# EAGLE design smarthome-agent-1 (EAGLE 9.1.0)
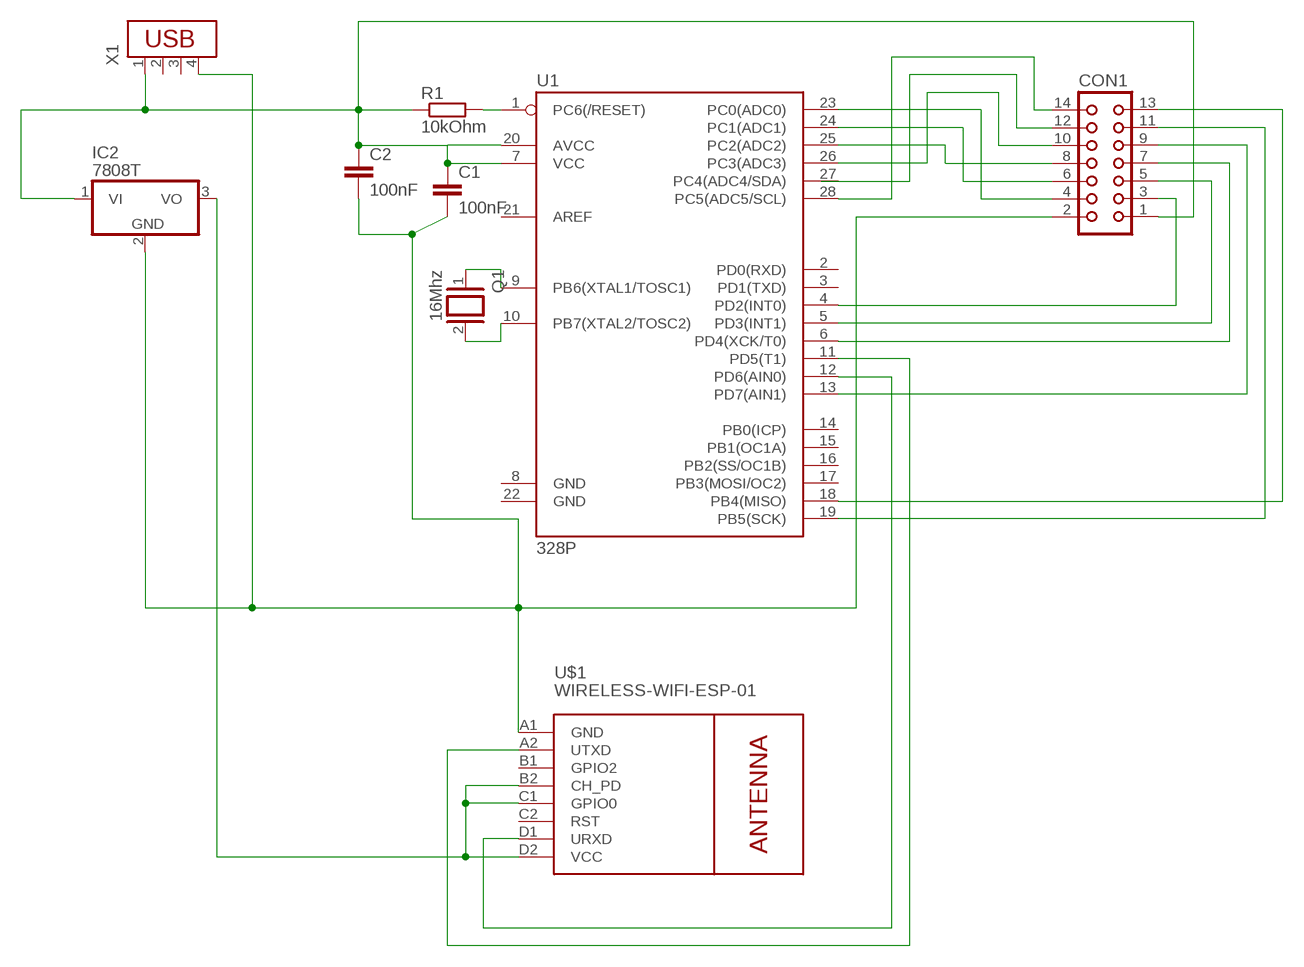
[diagram p0: schematic, sheet 1]

## Parts
C1  100nF  C-EU025-024X044  [C025-024X044]
C2  100nF  C-EU025-024X044  [C025-024X044]
CON1  CON14  [CON14]
IC2  7808T  [TO220H]
Q1  16Mhz  XTAL/S  [QS]
R1  10kOhm  R-EU_0204/7  [0204/7]
U1  328P  ATMEGA328P_PDIP  [DIP28]
U$1  WIRELESS-WIFI-ESP-01  [WIRELESS-WIFI-ESP-01]
X1  USB-787616  [USB]

## Nets
N$1: R1.2 U1.1(PC6(/RESET))
N$2: IC2.3(VO) U$1.B2(CH_PD) U$1.C1(GPIO0) U$1.D2(VCC)
N$3: Q1.2 U1.10(PB7(XTAL2/TOSC2))
N$4: Q1.1 U1.9(PB6(XTAL1/TOSC1))
N$5: U1.11(PD5(T1)) U$1.A2(UTXD)
N$6: U1.12(PD6(AIN0)) U$1.D1(URXD)
N$7: CON1.10 U1.26(PC3(ADC3))
N$8: CON1.4 U1.23(PC0(ADC0))
N$9: CON1.6 U1.24(PC1(ADC1))
N$10: CON1.8 U1.25(PC2(ADC2))
N$11: CON1.12 U1.27(PC4(ADC4/SDA))
N$12: CON1.3 U1.4(PD2(INT0))
N$13: CON1.5 U1.5(PD3(INT1))
N$14: CON1.7 U1.6(PD4(XCK/T0))
N$15: CON1.9 U1.13(PD7(AIN1))
N$16: CON1.11 U1.19(PB5(SCK))
N$17: C1.1 C2.1 CON1.1 IC2.1(VI) R1.1 U1.7(VCC) U1.20(AVCC) X1.1
N$18: C1.2 C2.2 CON1.2 IC2.2(GND) U$1.A1(GND) X1.4
N$19: CON1.13 U1.18(PB4(MISO))
N$20: CON1.14 U1.28(PC5(ADC5/SCL))
Unconnected: U1.2(PD0(RXD)) U1.3(PD1(TXD)) U1.8(GND) U1.14(PB0(ICP)) U1.15(PB1(OC1A)) U1.16(PB2(SS/OC1B)) U1.17(PB3(MOSI/OC2)) U1.21(AREF) U1.22(GND) U$1.B1(GPIO2) U$1.C2(RST) X1.2 X1.3

## Library data of the parts
C1 C2 = rcl:C-EU: CAPACITOR, European symbol; SPICEPREFIX: C
CON1 = con-harting:CON14: CONNECTOR; OC_FARNELL: unknown; OC_NEWARK: unknown
IC2 = linear:78*: Positive VOLTAGE REGULATOR Source: http://cache.national.com/ds/LM/LM78L05.pdf http://www.fairchildsemi.com/ds/LM/LM7805.pdf
Q1 = special:XTAL/S: CRYSTAL
R1 = rcl:R-EU_: RESISTOR, European symbol; SPICEPREFIX: R
U1 = SparkFun-IC-Microcontroller:ATMEGA328P_PDIP: Atmel 328P Through hole ATMEGA328P uC used in the Arduino 32kb flash, 1k EEPROM, 2k SRAM Datasheet <http://www.sparkfun.com/datasheets/Components/SMD/ATMega328.pdf> SparkFun Products Storefront component: AVR 28 Pin 20MHz 32K 6A/D - ATMega328P <https://www.sparkfun.com/products/9061> (COM-09061) SparkFun Simon Says - Through-Hole Soldering Kit <https://www.sparkfun.com/products/10547> (KIT-10547) SparkFun Learn to Solder - Simon Says <https://www.sparkfun.com/products/13708> (KIT-13708) SparkFun BigTime Watch Kit <https://www.sparkfun.com/products/11734> (KIT-11734) SparkFun ClockIt <https://www.sparkfun.com/products/10930> (KIT-10930) SparkFun Serial Enabled LCD Kit <https://www.sparkfun.com/products/10097> (LCD-10097) SparkFun Simon Tilts - Through Hole Soldering Kit <https://www.sparkfun.com/products/12634> (KIT-12634) SparkFun Frequency Counter Kit <https://www.sparkfun.com/products/10140> (KIT-10140) FabFM Radio Kit <https://www.sparkfun.com/products/11043> (KIT-11043) SparkFun Binary Blaster Kit <https://www.sparkfun.com/products/12037> (KIT-12037) SparkFun Metro-Gnome <https://www.sparkfun.com/products/9236> (KIT-09236) ATmega328 with Arduino Optiboot (Uno) <https://www.sparkfun.com/products/10524> (DEV-10524); PROD_ID: IC-09136
U$1 = diy-modules:WIRELESS-WIFI-ESP-01: Wireless Wi-Fi ESP-01 Module based on ESP8266 chip Click here to find device on ebay.com <http://www.ebay.com/sch/esp8266+esp+01+transceiver>
X1 = con-amp:USB-787616: AMP connector

## Board
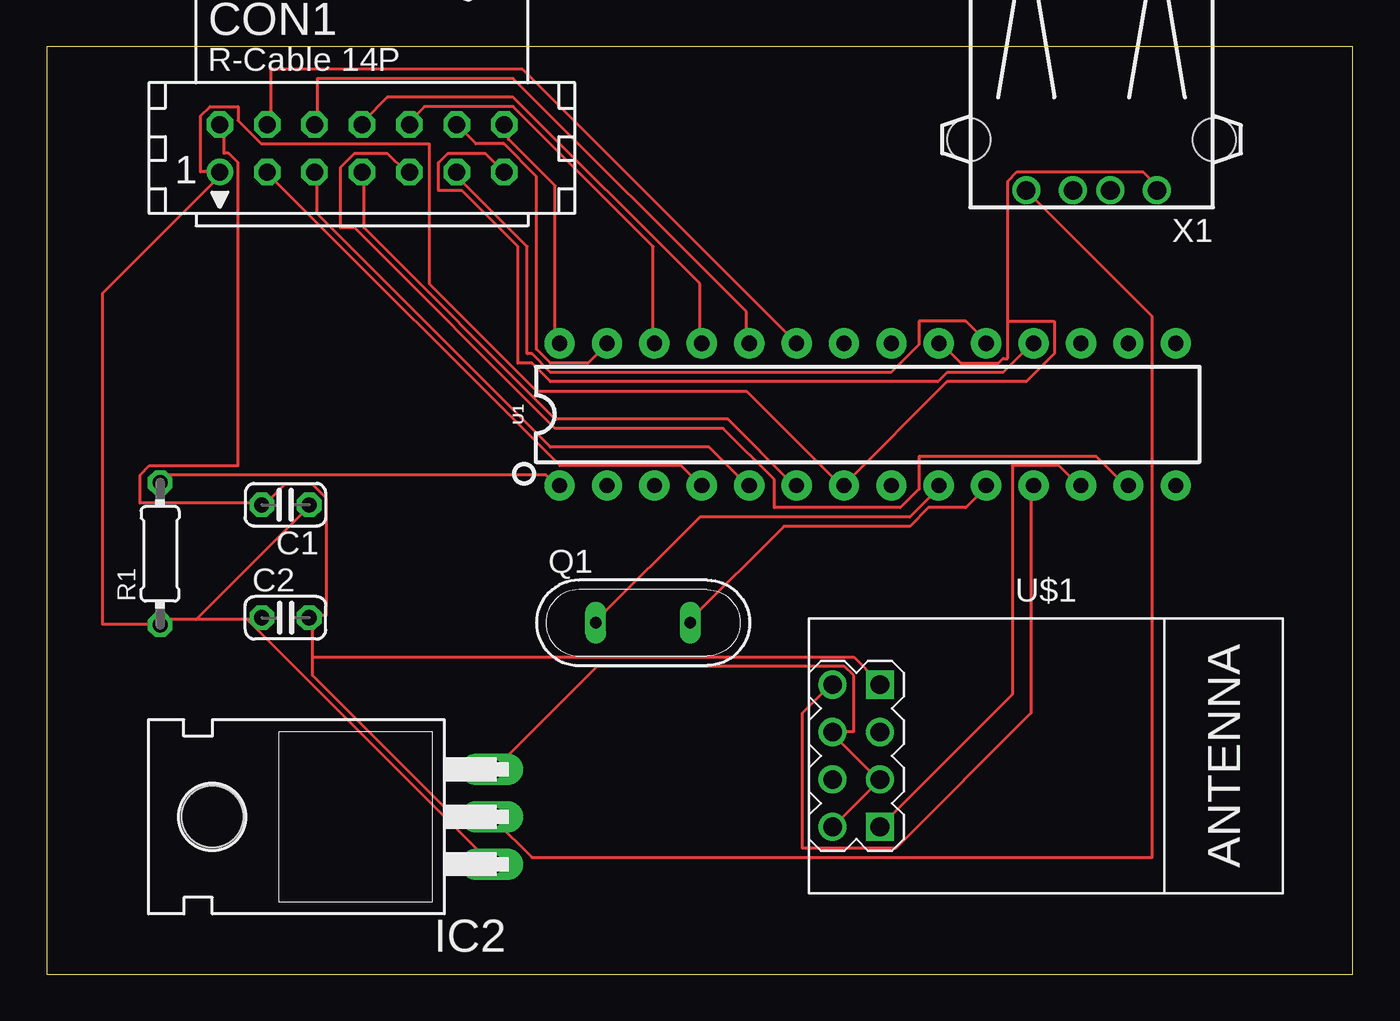
[diagram p1: board, top side]

Size 70 x 49.71 mm. Coordinates in mm from the lower left corner, seen from the top.
Outline: 0,0 70,0 70,49.71 0,49.71 0,0
Copper layers (1*16): Top 0.035mm / dielectric 1.5mm / Bottom 0.035mm
Design rules "default": minimum track width 6mil, minimum drill 0.35mm, track to track 6mil, track to pad 6mil, pad to pad 6mil, via to via 6mil, smd to smd 6mil, copper to edge 40mil, drill to drill 6mil, minimum pad ring 10mil, minimum via ring 8mil, stop-mask expansion 4mil, vias tented up to drill 0mil, thermal gap 10mil

### Footprints (pad centres in the part's own frame; a part is rotated, then mirrored left to right if it is on the bottom)
C025-024X044 = drill 0.813 octagon: 1 -1.27,0; 2 1.27,0
CON14 = drill 0.914: 1 -7.62,-1.27 | drill 0.914 octagon: 2 -7.62,1.27; 3 -5.08,-1.27; 4 -5.08,1.27; 5 -2.54,-1.27; 6 -2.54,1.27; 7 0,-1.27; 8 0,1.27; 9 2.54,-1.27; 10 2.54,1.27; 11 5.08,-1.27; 12 5.08,1.27; 13 7.62,-1.27; 14 7.62,1.27
TO220H = drill 1.118 long: 1 -2.54,-10.16; 2 0,-10.16; 3 2.54,-10.16 | hole 3.302: 0,4.826
QS = drill 0.61 long: 1 -2.54,0; 2 2.54,0
0204/7 = drill 0.813 octagon: 1 -3.81,0; 2 3.81,0
DIP28 = drill 0.813 pad 1.626: 1 -16.51,-3.81; 2 -13.97,-3.81; 3 -11.43,-3.81; 4 -8.89,-3.81; 5 -6.35,-3.81; 6 -3.81,-3.81; 7 -1.27,-3.81; 8 1.27,-3.81; 9 3.81,-3.81; 10 6.35,-3.81; 11 8.89,-3.81; 12 11.43,-3.81; 13 13.97,-3.81; 14 16.51,-3.81; 15 16.51,3.81; 16 13.97,3.81; 17 11.43,3.81; 18 8.89,3.81; 19 6.35,3.81; 20 3.81,3.81; 21 1.27,3.81; 22 -1.27,3.81; 23 -3.81,3.81; 24 -6.35,3.81; 25 -8.89,3.81; 26 -11.43,3.81; 27 -13.97,3.81; 28 -16.51,3.81
WIRELESS-WIFI-ESP-01 = drill 1 square: A1 -8.89,3.81; D1 -8.89,-3.81 | drill 1: A2 -11.43,3.81; B1 -8.89,1.27; B2 -11.43,1.27; C1 -8.89,-1.27; C2 -11.43,-1.27; D2 -11.43,-3.81
USB = drill 1: 1 -3.5,12.99; 2 -1,12.99; 3 1,12.99; 4 3.5,12.99 | hole 2.3: -6.57,10.28; 6.57,10.28

### Placement (x,y rotation side)
C1  12.8,25.15 180 top
C2  12.8,19.1 0 top
CON1  16.9,44.26 0 top
IC2  13.7,8.43 90 top
Q1  31.96,18.83 0 top
R1  6.08,22.53 90 top
U1  44,30 0 top
U$1  53.55,11.7 0 top
X1  56,55 180 top

### Tracks (layer width: path | path; a pad name or v marks a point on that pad's centre or on a via)
N$1
  Top 0.152: R1.2 6.25,26.5 6.5,26.75 26.75,26.75 27.25,26.25 U1.1
N$2
  Top 0.152: U$1.D2 42.25,8 44.5,10.25 U$1.C1 44.5,10.5 42.25,12.75 U$1.B2 42.25,13 43.25,13 43.25,16 42.75,16.5 29.5,16.5 24,11 IC2.3
N$3
  Top 0.152: Q1.2 34.5,19 39.5,24 46.25,24 47.25,25 49.25,25 50.25,26 U1.10
N$4
  Top 0.152: Q1.1 29.5,19 35,24.5 46.25,24.5 47.75,26 U1.9
N$5
  Top 0.152: U$1.A2 42,15.5 40.5,14 40.5,6.75 45.5,6.75 52.75,14 52.75,26 U1.11
N$6
  Top 0.152: U$1.D1 44.75,8 51.75,15 51.75,27.25 54.25,27.25 55.25,26.25 U1.12
N$7
  Top 0.152: CON1.10 19.5,45.75 20.25,46.5 25,46.5 32.5,39 32.5,34 U1.26
N$8
  Top 0.152: U1.23 25.5,48.5 12,48.5 12,45.75 CON1.4
N$9
  Top 0.152: CON1.6 14.5,45.75 14.5,48 25,48 37.5,35.5 37.5,34 U1.24
N$10
  Top 0.152: CON1.8 17,45.75 18.25,47 25,47 35,37 35,34 U1.25
N$11
  Top 0.152: CON1.12 22,45.5 23,44.5 24.5,44.5 26.25,42.75 26.25,33.5 27,32.75 29,32.75 30,33.75 U1.27
N$12
  Top 0.152: CON1.3 12,42.75 27.5,27.25 34,27.25 35,26.25 U1.4
N$13
  Top 0.152: CON1.5 14.5,42.75 14.5,40.75 27,28.25 35.5,28.25 37.5,26.25 U1.5
N$14
  Top 0.152: CON1.7 17,42.75 17,40 27.25,29.75 36.5,29.75 40,26.25 U1.6
N$15
  Top 0.152: CON1.9 19.25,43 18.25,44 16.5,44 15.75,43.25 15.75,40 16.5,40 27.25,29.25 36.25,29.25 39,26.5 39,25 45.75,25 46.75,26 46.75,27.75 56.25,27.75 57.75,26.25 U1.13
N$16
  Top 0.152: CON1.11 22,42.75 25.75,39 25.75,33.25 26,33.25 27,32.25 45.25,32.25 46.75,33.75 46.75,35 49.25,35 50.25,34 U1.19
N$17
  Top 0.152: 51.5,35 51.5,33 51.25,33 51,32.75 49,32.75 48,33.75 U1.20 | 51.5,35 51.5,42.5 52,43 58.75,43 59.5,42.25 X1.1 | 51.5,35 54,35 54,33.25 52.5,31.75 48.25,31.75 42.75,26.25 U1.7 42.5,26.25 37.5,31.25 26.25,31.25 20.5,37 20.5,44.5 11.5,44.5 10.25,45.75 10.25,46.5 8.75,46.5 8.25,46 8.25,43 9.25,43 CON1.1 9.25,42.75 3,36.5 3,18.75 6,18.75 R1.1 6.25,18.75 6.5,19 8,19 | 10.75,19 11.5,19 C2.1 | 10.75,19 8,19 | 8,19 14,25 C1.1 | 10.75,19 IC2.1
N$18
  Top 0.152: 14.25,17 14.25,16 21.75,8.5 23.75,8.5 IC2.2 24,8.25 26,6.25 59.25,6.25 59.25,35.25 X1.4 | 14.25,17 14.25,19 C2.2 14.25,19.25 15,19.25 15,25.5 14.25,26.25 12.75,26.25 11.75,25.25 C1.2 11.5,25.25 5,25.25 5,26.75 5.5,27.25 10.25,27.25 10.25,43.5 9.75,44 9.5,44 9.5,45.5 CON1.2 | 14.25,17 43.25,17 44.5,15.75 U$1.A1
N$19
  Top 0.152: CON1.13 24.5,43 23.5,44 21.5,44 21,43.5 21,42 22.25,42 25.25,39 25.25,32.75 26,32.75 27,31.75 47.75,31.75 48.25,32.25 51.25,32.25 52.75,33.75 U1.18
N$20
  Top 0.152: CON1.14 24.75,45.5 24.75,44.75 27.25,42.25 27.25,34 U1.28